# EAGLE design neopixelwordclock (EAGLE 7.6.0)
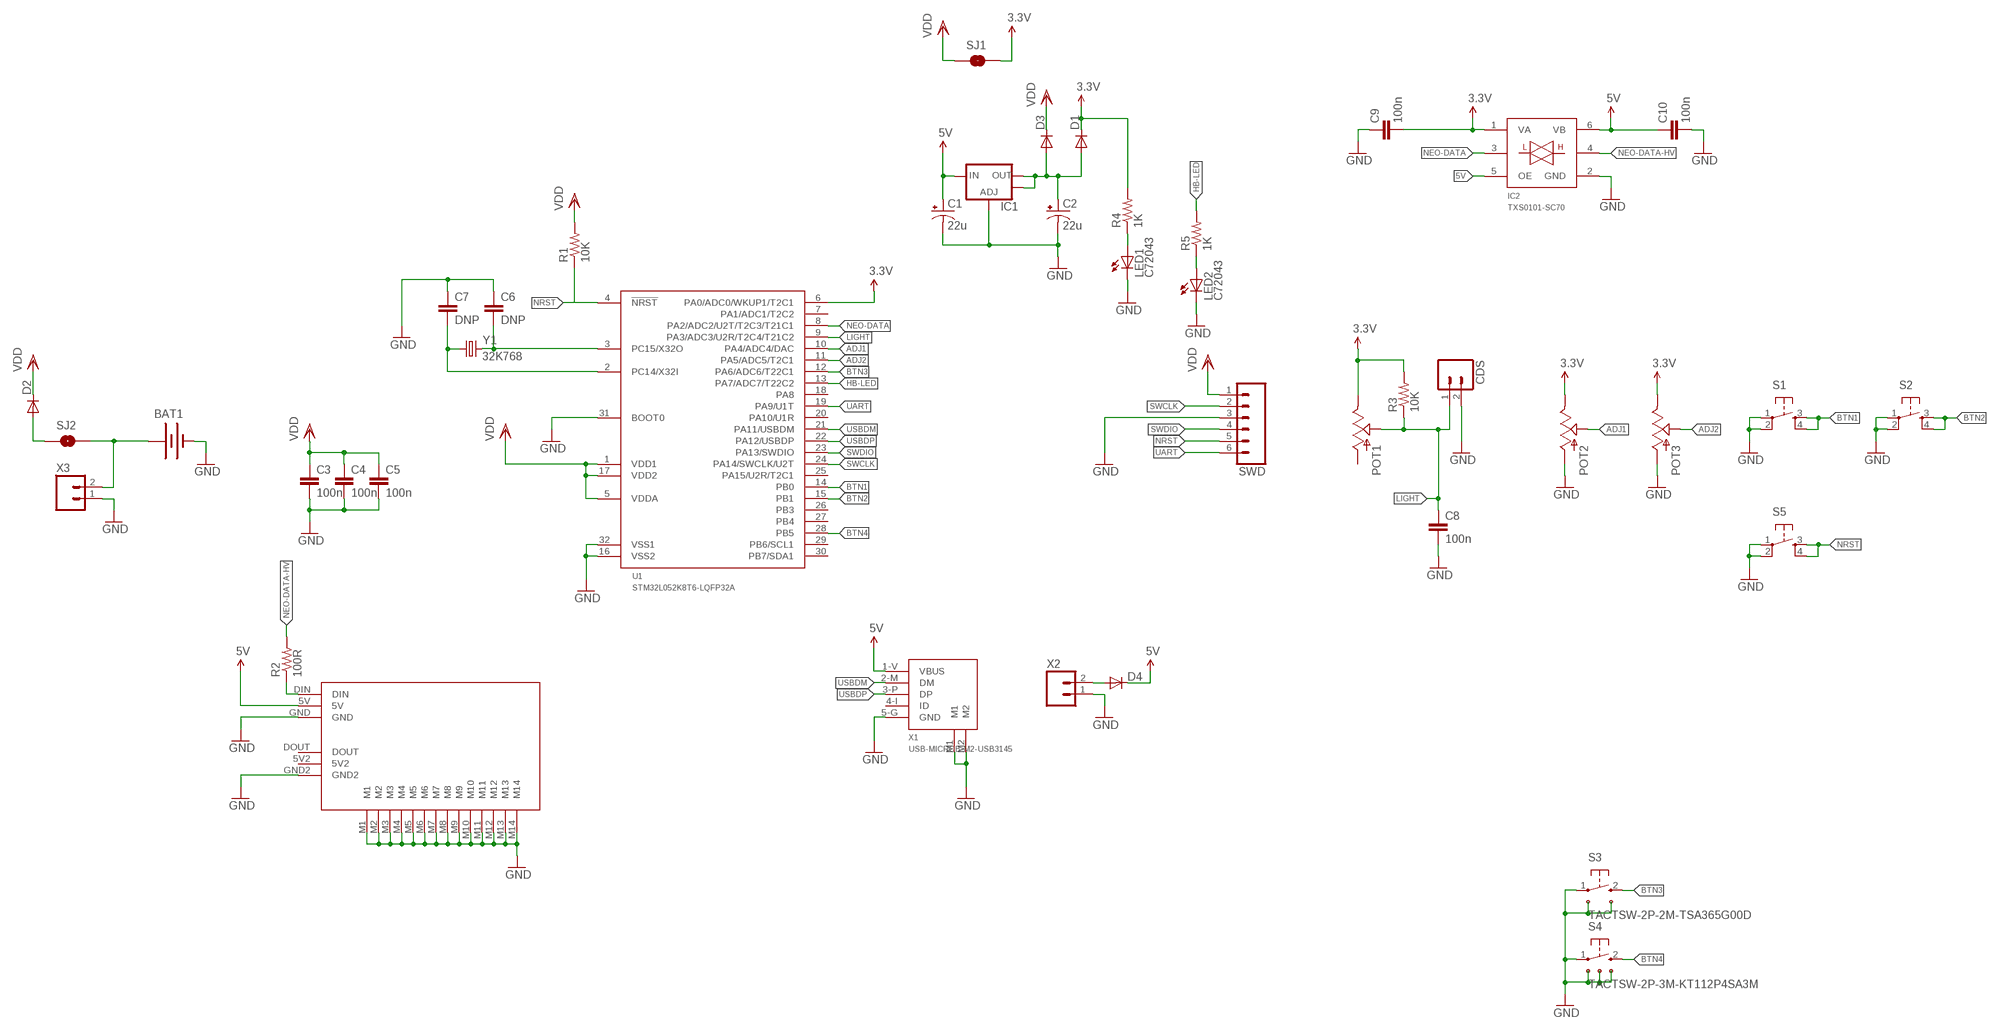
[diagram p0: schematic, sheet 1]

## Parts
BAT1  BATTERY-JLC  [BATT-COIN-CR2032-BS-6-1]
C1  22u  CAP_POL3528  [EIA3528]
C2  22u  CAP_POL3528  [EIA3528]
C3  100n  CAP0603-CAP  [0603-CAP]
C4  100n  CAP0603-CAP  [0603-CAP]
C5  100n  CAP0603-CAP  [0603-CAP]
C6  DNP  CAP0603-CAP  [0603-CAP]
C7  DNP  CAP0603-CAP  [0603-CAP]
C8  100n  CAP0603-CAP  [0603-CAP]
C9  100n  CAP0603-CAP  [0603-CAP]
C10  100n  CAP0603-CAP  [0603-CAP]
CDS  M02PTH  [1X02]
D1  DIODESOD  [SOD-323]
D2  DIODESOD  [SOD-323]
D3  DIODESOD  [SOD-323]
D4  DIODESMA  [SMA-DIODE]
IC1  V_REG_LM1117SOT223  [SOT223]
IC2  TXS0101-SC70  [SC70-6]
LED1  C72043  LED0603  [LED-0603]
LED2  C72043  LED0603  [LED-0603]
POT1  POT-SMD-A  [POT-SMD]
POT2  POT-SMD-A  [POT-SMD]
POT3  POT-SMD-A  [POT-SMD]
R1  10K  RESISTOR0603-RES  [0603-RES]
R2  100R  RESISTOR0603-RES  [0603-RES]
R3  10K  RESISTOR0603-RES  [0603-RES]
R4  1K  RESISTOR0603-RES  [0603-RES]
R5  1K  RESISTOR0603-RES  [0603-RES]
S1  TAC_SWITCHSMD  [TACTILE_SWITCH_SMD]
S2  TAC_SWITCHSMD  [TACTILE_SWITCH_SMD]
S3  TACTSW-2P-2M-TSA365G00D  [TACTSW-SMD-SIDE-TSA365G00D]
S4  TACTSW-2P-3M-KT112P4SA3M  [TACTSW-SMD-SIDE-KT11P4SA3M]
S5  TAC_SWITCHSMD  [TACTILE_SWITCH_SMD]
SJ1  SOLDERJUMPERNO  [SJ_2S-NO]
SJ2  SOLDERJUMPER-BIG  [SJ_2S_BIG]
SWD  M06FEMALE_LOCK  [1X06_FEMALE_LOCK.010]
U1  STM32L052K8T6-LQFP32A  [LQFP32]
U$1  PCB-OUTLINE  [PCB-OUTLINE]
X1  USB-MICROB-M2-USB3145  [USBMICROBVERT-USB3145]
X2  M02-JST-2-PTH-NO_SILK  [JST-2-PTH-NS]
X3  M02-JST-2-PTH-NO_SILK  [JST-2-PTH-NS]
Y1  32K768  CRYSTAL-3.2X1.5  [XTAL-3.2X1.5]

## Nets
3.3V: C9.2 D1.1(C) IC2.1(VA) POT1.A(B) POT2.A(B) POT3.A(B) R3.2 R4.2 SJ1.2 U1.6(PA0/ADC0/WKUP1/T2C1)
5V: C1.A(+) C10.1 D4.C IC1.3(IN) IC2.5(OE) IC2.6(VB) U$1.5V X1.1-V(VBUS)
ADJ1: POT2.W U1.10(PA4/ADC4/DAC)
ADJ2: POT3.W U1.11(PA5/ADC5/T2C1)
BTN1: S1.3 S1.4 U1.14(PB0)
BTN2: S2.3 S2.4 U1.15(PB1)
BTN3: S3.2 U1.12(PA6/ADC6/T22C1)
BTN4: S4.2 U1.28(PB5)
GND: BAT1.NEG(-) C1.C(-) C2.C(-) C3.2 C4.2 C5.2 C6.1 C7.1 C8.2 C9.1 C10.2 CDS.2 IC1.1(ADJ) IC2.2(GND) LED1.C LED2.C POT2.B(A) POT3.B(A) S1.1 S1.2 S2.1 S2.2 S3.1 S3.M1 S3.M2 S4.1 S4.M1 S4.M2 S4.M3 S5.1 S5.2 SWD.3 U1.16(VSS2) U1.31(BOOT0) U1.32(VSS1) U$1.GND U$1.GND2 U$1.M1 U$1.M2 U$1.M3 U$1.M4 U$1.M5 U$1.M6 U$1.M7 U$1.M8 U$1.M9 U$1.M10 U$1.M11 U$1.M12 U$1.M13 U$1.M14 X1.5-G(GND) X1.M1 X1.M2 X2.1 X3.1
HB-LED: R5.2 U1.13(PA7/ADC7/T22C2)
LIGHT: C8.1 CDS.1 POT1.W R3.1 U1.9(PA3/ADC3/U2R/T2C4/T21C2)
N$1: BAT1.POS(+) SJ2.2 X3.2
N$2: C2.A(+) D1.2(A) D3.2(A) IC1.2(OUT) IC1.4(OUT)
N$3: C6.2 U1.3(PC15/X32O) Y1.2
N$4: C7.2 U1.2(PC14/X32I) Y1.1
N$5: R2.1 U$1.DIN
N$6: D4.A X2.2
N$7: D2.2(A) SJ2.1
N$8: LED2.A R5.1
N$9: LED1.A R4.1
NEO-DATA: IC2.3(A) U1.8(PA2/ADC2/U2T/T2C3/T21C1)
NEO-DATA-HV: IC2.4(B) R2.2
NRST: R1.1 S5.3 S5.4 SWD.5 U1.4(!NRST)
SWCLK: SWD.2 U1.24(PA14/SWCLK/U2T)
SWDIO: SWD.4 U1.23(PA13/SWDIO)
UART: SWD.6 U1.19(PA9/U1T)
USBDM: U1.21(PA11/USBDM) X1.2-M(DM)
USBDP: U1.22(PA12/USBDP) X1.3-P(DP)
VDD: C3.1 C4.1 C5.1 D2.1(C) D3.1(C) R1.2 SJ1.1 SWD.1 U1.1(VDD1) U1.5(VDDA) U1.17(VDD2)
Unconnected: POT1.B(A) U1.7(PA1/ADC1/T2C2) U1.18(PA8) U1.20(PA10/U1R) U1.25(PA15/U2R/T2C1) U1.26(PB3) U1.27(PB4) U1.29(PB6/SCL1) U1.30(PB7/SDA1) U$1.5V2 U$1.DOUT X1.4-I(ID)

## Library data of the parts
BAT1 = neopixelwordclock:BATTERY: Battery Holders Various common sizes : AA, AAA, 20mm coin cell and 12mm coin cell.
C1 C2 = neopixelwordclock:CAP_POL: Capacitor Polarized These are standard SMD and PTH capacitors. Normally 10uF, 47uF, and 100uF in electrolytic and tantalum varieties. Always verify the external diameter of the through hole cap, it varies with capacity, voltage, and manufacturer. The EIA devices should be standard.
C3-C10 = neopixelwordclock:CAP: Capacitor Standard 0603 ceramic capacitor, and 0.1" leaded capacitor.
CDS X2 X3 = neopixelwordclock:M02: Header 2 Standard 2-pin 0.1" header. Use with straight break away headers (SKU : PRT-00116), right angle break away headers (PRT-00553), swiss pins (PRT-00743), machine pins (PRT-00117), and female headers (PRT-00115). Molex polarized connector foot print use with SKU : PRT-08233 with associated crimp pins and housings.
D1-D4 = neopixelwordclock:DIODE: Diode These are standard reverse protection diodes and small signal diodes. SMA package can handle up to about 1A. SOD-323 can handle about 200mA. What the SOD-323 package when ordering, there are some mfgs out there that are 5-pin packages.
IC1 = neopixelwordclock:V_REG_LM1117: Voltage Regulator LM1117 Standard adjustable voltage regulator but in SMD form. Spark Fun Electronics SKU : COM-00595
IC2 = neopixelwordclock:TXS0101
LED1 LED2 = neopixelwordclock:LED: LEDs Standard schematic elements and footprints for 5mm, 3mm, 1206, and 0603 sized LEDs. 5mm - Spark Fun Electronics SKU : COM-00529 (and others)
POT1-POT3 = neopixelwordclock:POT
R1-R5 = neopixelwordclock:RESISTOR: Resistor Basic schematic elements and footprints for 0603, 1206, and PTH resistors.
S1 S2 S5 = neopixelwordclock:TAC_SWITCH: Momentary Switch Button commonly used for reset or general input. Spark Fun Electronics SKU : COM-00097
S3 = neopixelwordclock:TACTSW-2P-2M
S4 = neopixelwordclock:TACTSW-2P-3M
SJ1 SJ2 = neopixelwordclock:SOLDERJUMPER: Solder Jumper Standard SMD solder jumper. Used to automate production. Two varients : Normally Open and Normally Closed are the same, but have different paste layers. NC will have a large amount of paste and should jumper during reflow.
SWD = neopixelwordclock:M06: Header 6 Standard 6-pin 0.1" header. Use with straight break away headers (SKU : PRT-00116), right angle break away headers (PRT-00553), swiss pins (PRT-00743), machine pins (PRT-00117), and female headers (PRT-00115). Molex polarized connector foot print use with SKU : PRT-08094 with associated crimp pins and housings. NOTES ON THE VARIANTS LOCK and LOCK_LONGPADS... This footprint was designed to help hold the alignment of a through-hole component (i.e. 6-pin header) while soldering it into place. You may notice that each hole has been shifted either up or down by 0.005 of an inch from it's more standard position (which is a perfectly straight line). This slight alteration caused the pins (the squares in the middle) to touch the edges of the holes. Because they are alternating, it causes a "brace" to hold the component in place. 0.005 has proven to be the perfect amount of "off-center" position when using our standard breakaway headers. Although looks a little odd when you look at the bare footprint, once you have a header in there, the alteration is very hard to notice. Also, if you push a header all the way into place, it is covered up entirely on the bottom side. This idea of altering the position of holes to aid alignment will be further integrated into the Sparkfun Library for other footprints. It can help hold any component with 3 or more connection pins.
U1 = neopixelwordclock:STM32L052K8T6
U$1 = neopixelwordclock:PCB-OUTLINE
X1 = neopixelwordclock:USB-MICROB-M2
Y1 = neopixelwordclock:CRYSTAL: Crystals Various standard crystals. Proven footprints. Spark Fun Electronics SKU : COM-00534

## Board
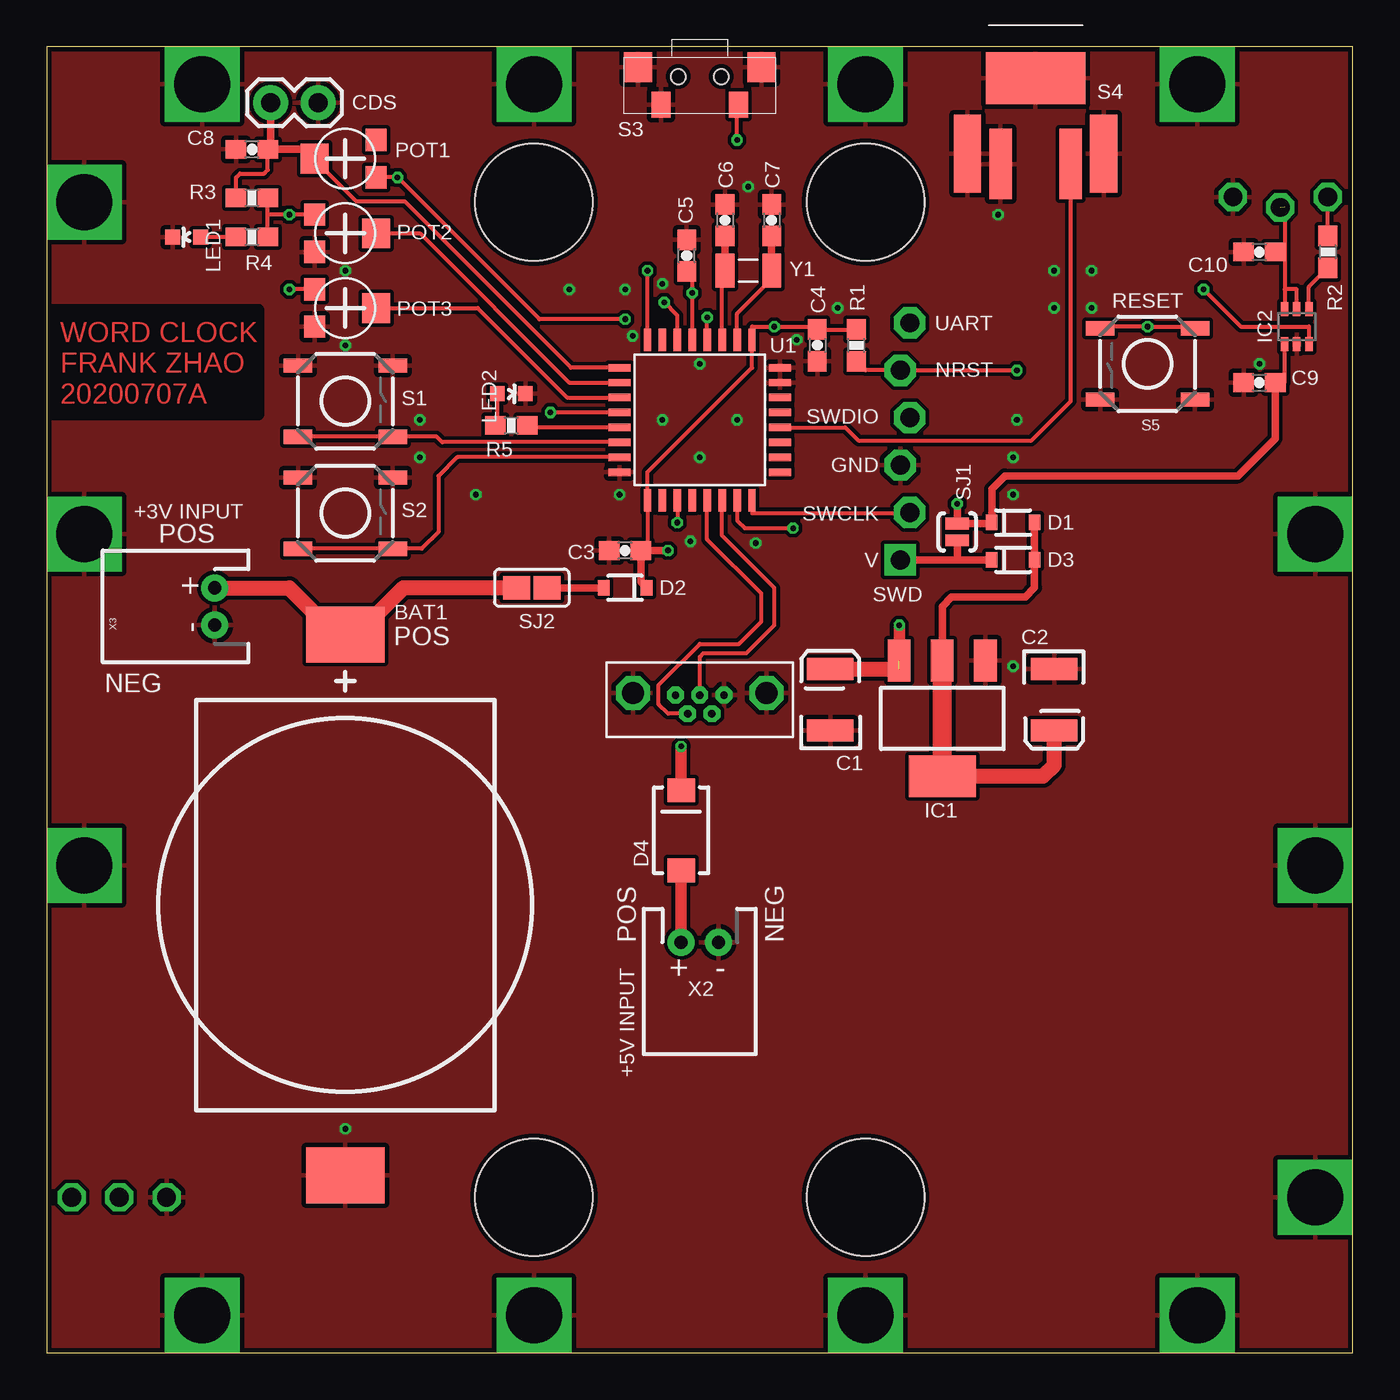
[diagram p1: board, top side]
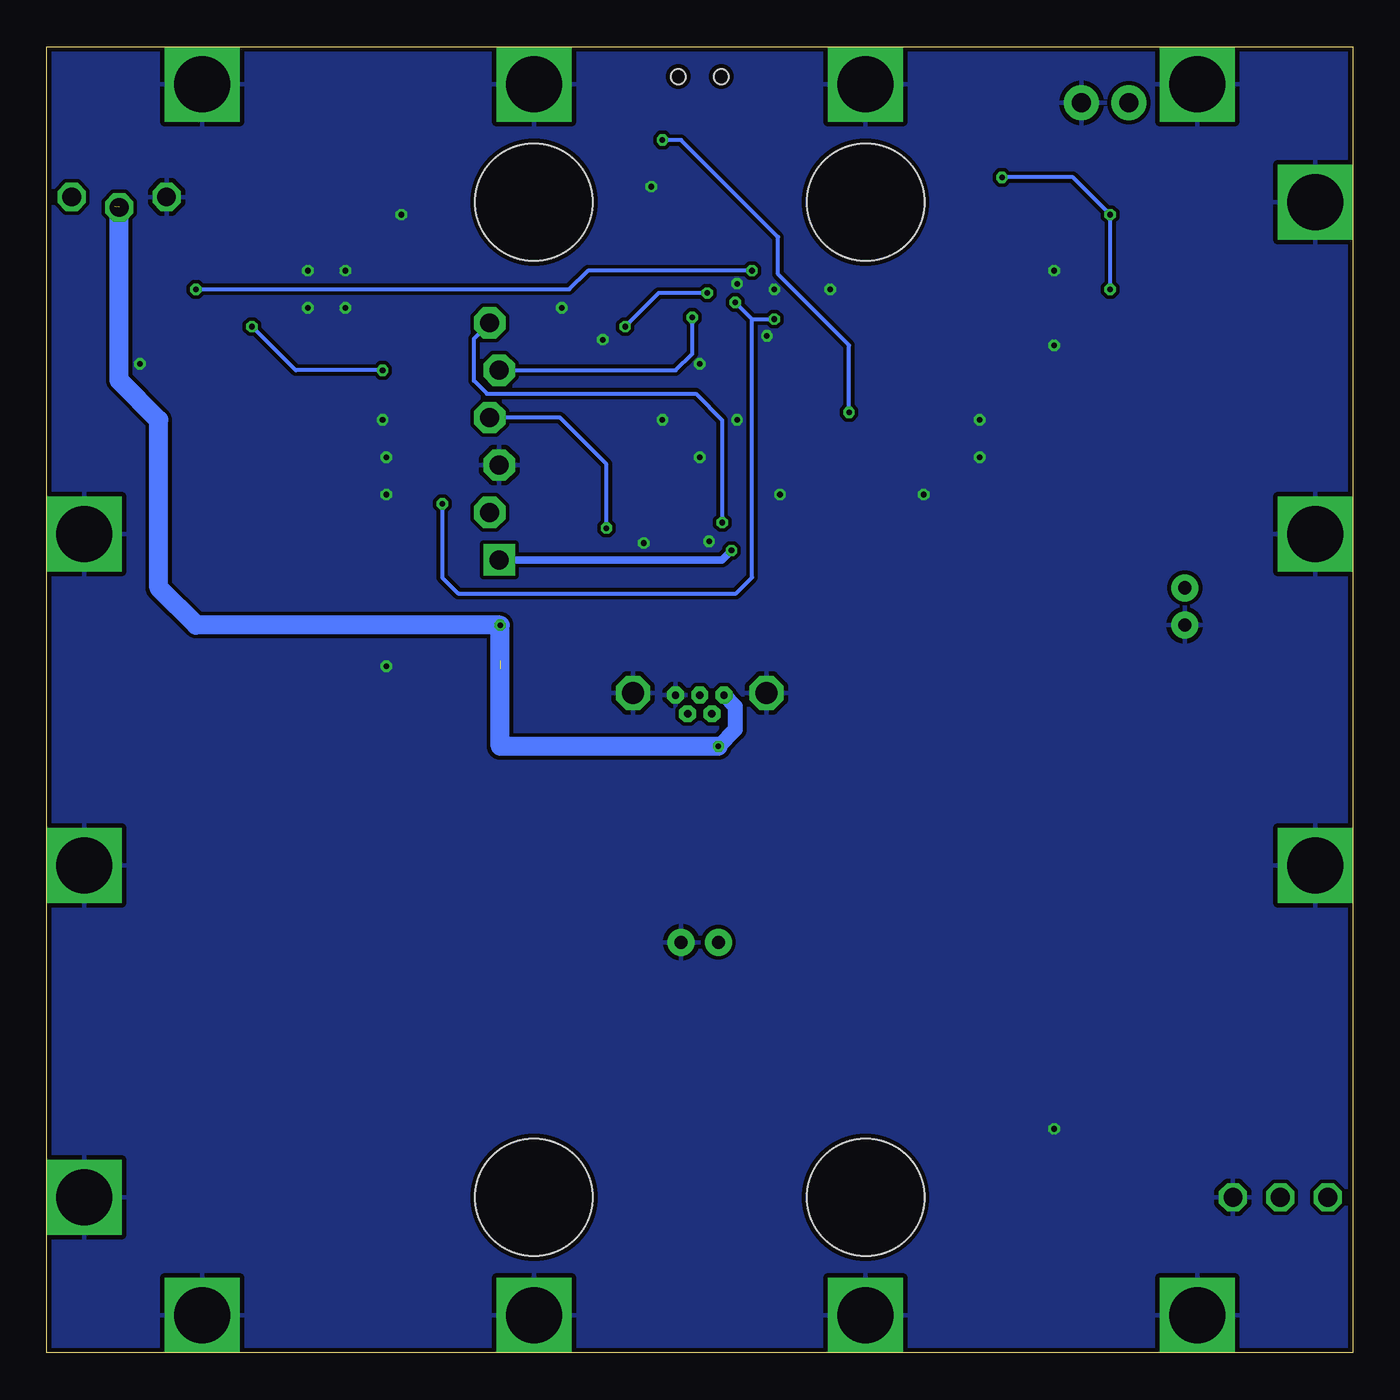
[diagram p2: board, bottom side, seen from below]

Size 70 x 70 mm. Coordinates in mm from the lower left corner, seen from the top.
Copper layers (1*16): Top 0.035mm / dielectric 1.5mm / Bottom 0.035mm
Design rules "designrulecheck": minimum track width 6mil, minimum drill 0.3mm, track to track 7mil, track to pad 7mil, pad to pad 7mil, via to via 7mil, smd to smd 0mil, copper to edge 10mil, drill to drill 10mil, minimum pad ring 10mil, minimum via ring 6mil, stop-mask expansion 2mil, vias tented up to drill 25mil, thermal gap 10mil

### Footprints (pad centres in the part's own frame; a part is rotated, then mirrored left to right if it is on the bottom)
BATT-COIN-CR2032-BS-6-1 = smd 3 x 4.2: NEG -14.5,0; POS 14.5,0
EIA3528 = smd 1.2 x 2.5: A 1.65,0; C -1.65,0
0603-CAP = smd 1.1 x 1: 1 -0.85,0; 2 0.85,0
1X02 = drill 1.016 pad 1.88: 1 0,0; 2 2.54,0
SOD-323 = smd 0.63 x 0.83: 1 -1.15,0; 2 1.15,0
SMA-DIODE = smd 1.27 x 1.47: A -2.15,0; C 2.15,0
SOT223 = smd 1.219 x 2.235: 1 -2.311,-3.099; 2 0,-3.099; 3 2.311,-3.099 | smd 3.6 x 2.2: 4 0,3.099
SC70-6 = smd 0.4 x 0.75: 1 -0.65,-0.925; 2 0,-0.925; 3 0.65,-0.925; 4 0.65,0.925; 5 0,0.925; 6 -0.65,0.925
LED-0603 = smd 0.8 x 0.8: A -0.75,0; C 0.75,0
POT-SMD = smd 1.2 x 1.12: A -1,-1.65; B 1,-1.65 | smd 1.6 x 1.5: W 0,1.65
0603-RES = smd 1.1 x 1: 1 -0.85,0; 2 0.85,0
TACTILE_SWITCH_SMD = smd 1.524 x 0.762: 1 -2.54,1.905; 2 2.54,1.905; 3 -2.54,-1.905; 4 2.54,-1.905
TACTSW-SMD-SIDE-TSA365G00D = smd 1 x 1.4: 1 -2.075,-1.5; 2 2.075,-1.5 | smd 1.5 x 1.6: M1 -3.3,0.5; M2 3.3,0.5 | hole 0.8: -1.15,0; 1.15,0
TACTSW-SMD-SIDE-KT11P4SA3M = smd 3.759 x 1.206: 1 3.581,-1.88; 2 3.581,1.88 | smd 2.794 x 5.334: M1 -1.016,0 | smd 4.191 x 1.46: M2 3.035,-3.651; M3 3.035,3.651
SJ_2S-NO = smd 0.635 x 1.27: 1 -0.45,0; 2 0.45,0
SJ_2S_BIG = smd 1.435 x 1.27: 1 -0.812,0; 2 0.812,0
1X06_FEMALE_LOCK.010 = drill 1.016 pad 1.676 square: 1 0,0.254 | drill 1.016 pad 1.676 octagon: 2 2.54,-0.254; 3 5.08,0.254; 4 7.62,-0.254; 5 10.16,0.254; 6 12.7,-0.254
LQFP32 = smd 0.4 x 1.2: 1 -2.8,-4.3; 2 -2,-4.3; 3 -1.2,-4.3; 4 -0.4,-4.3; 5 0.4,-4.3; 6 1.2,-4.3; 7 2,-4.3; 8 2.8,-4.3; 17 2.8,4.3; 18 2,4.3; 19 1.2,4.3; 20 0.4,4.3; 21 -0.4,4.3; 22 -1.2,4.3; 23 -2,4.3; 24 -2.8,4.3 | smd 1.2 x 0.4: 9 4.3,-2.8; 10 4.3,-2; 11 4.3,-1.2; 12 4.3,-0.4; 13 4.3,0.4; 14 4.3,1.2; 15 4.3,2; 16 4.3,2.8; 25 -4.3,2.8; 26 -4.3,2; 27 -4.3,1.2; 28 -4.3,0.4; 29 -4.3,-0.4; 30 -4.3,-1.2; 31 -4.3,-2; 32 -4.3,-2.8
PCB-OUTLINE = drill 1 octagon: 5V 31.12,26.39; 5V2 -31.12,-26.67; DIN 33.66,26.95; DOUT -33.66,-26.67; GND 28.58,26.95; GND2 -28.58,-26.67 | drill 3 pad 3.4 square: M1 -26.67,-33; M2 -8.89,-33; M3 8.89,-33; M4 26.67,-33; M5 33,-26.67; M6 33,-8.89; M7 33,8.89; M8 26.67,33; M9 8.89,33; M10 -8.89,33; M11 -26.67,33; M12 -33,26.67; M13 -33,8.89; M14 -33,-8.89 | hole 6.3: -8.89,26.67; 8.89,26.67; -8.89,-26.67; 8.89,-26.67
USBMICROBVERT-USB3145 = drill 0.4 pad 0.8 octagon: 1-V -1.3,0.25; 2-M -0.65,-0.75; 3-P 0,0.25; 4-I 0.65,-0.75; 5-G 1.3,0.25 | drill 1.2 octagon: M1 -3.575,0.36; M2 3.575,0.36
JST-2-PTH-NS = drill 0.7 pad 1.448: 1 -1,0; 2 1,0
XTAL-3.2X1.5 = smd 1 x 1.8: 1 -1.25,0; 2 1.25,0

### Placement (x,y rotation side)
BAT1  16,24 90 top
C1  42,35 90 top
C2  54,35 270 top
C3  31,43 180 top
C4  41.3,54 270 top
C5  34.3,58.8 90 top
C6  36.35,60.7 270 top
C7  38.85,60.7 270 top
C8  11,64.5 180 top
C9  65,52 0 top
C10  65,59 180 top
CDS  12,67 0 top
D1  51.8,44.5 0 top
D2  31,41 180 top
D3  51.8,42.5 0 top
D4  34,28 90 top
IC1  48,34 180 top
IC2  67,55 0 top
LED1  7.5,59.8 180 top
LED2  24.9,51.4 0 top
POT1  16,64 90 top
POT2  16,60 270 top
POT3  16,56 270 top
R1  43.4,54 90 top
R2  68.66,59 270 top
R3  11,61.9 0 top
R4  11,59.8 0 top
R5  24.9,49.7 0 top
S1  16,51 0 top
S2  16,45 0 top
S3  35,68.4 0 top
S4  53,67.3 270 top
S5  59,53 180 top
SJ1  48.8,44 90 top
SJ2  26,41 180 top
SWD  46,42.5 90 top
U1  35,50 180 top
U$1  35,35 0 top
X1  35,35 0 top
X2  35,22 180 top
X3  9,40 90 top
Y1  37.6,58 180 top

### Tracks (layer width: path | path; a pad name or v marks a point on that pad's centre or on a via)
3.3V  (via drill 0.3)
  Top 0.203: U1.6 33.8,55.6 v33.1,56.3 | v31,55.4 26.4,55.4 v18.8,63 POT1.A | POT3.A v13,57 | POT2.A v13,61 11.85,61 | C9.2 66.35,52 IC2.1 | 12.1,61.9 R3.2 11.85,61 | R4.2 11.85,61
  Top 0.406: v48.8,45.5 SJ1.2 50.4,44.45 D1.1 50.65,46.3 51.35,47 63.84,47 65.85,49.01 C9.2
  Bottom 0.203: v48.8,45.5 48.8,41.55 47.95,40.7 33.05,40.7 32.2,41.55 32.2,55.4 | 32.2,55.4 v33.1,56.3 | 32.2,55.4 v31,55.4 | v13,57 v13,61 15,63 v18.8,63
5V  (via drill 0.3)  (2 unrouted)
  Top 0.203: 66.35,61.44 66.35,59 | 66.35,59 66.35,57 | 66.35,57 IC2.6 | IC2.5 67,57 66.35,57 | C10.1 66.35,59
  Top 0.61: D4.C v34,32.5 | IC1.3 v45.7,39
  Top 0.813: C1.A 45.69,36.65
  Bottom 0.813: X1.1-V 33.1,34.65 33.1,33.4 v34,32.5
  Bottom 1.016: U$1.5V 66.12,52.12 64,50 64,41 62,39 v45.7,39 45.7,32.5 v34,32.5
ADJ1
  Top 0.203: POT2.W 20,60 28,52 U1.10
ADJ2
  Top 0.203: POT3.W 23.1,56 27.9,51.2 U1.11
BTN1
  Top 0.203: U1.14 21.2,48.8 20.91,49.09 S1.4 S1.3
BTN2
  Top 0.203: U1.15 22,48 21,47 21,44 20.09,43.09 S2.4 S2.3
BTN3  (via drill 0.3)
  Top 0.203: U1.12 v27,50.4 | v37,65 37,66.5 S3.2
  Bottom 0.203: v27,50.4 27,54 30.8,57.8 30.8,59.8 36,65 v37,65
BTN4
  Top 0.203: U1.28 42.8,49.6 43.5,48.9 52.78,48.9 54.88,51 S4.2
GND  (via drill 0.3)
  other vias: 16,12 51.8,36.8 34.5,43.5 38,43.4 30.7,46 33,50 35,48 37,50 35,53 40.2,54.3 37.6,62.5 31.4,54.5 33,57.3 16,58 16,54 51,61 56,56 54,56 54,58 56,58 65,53 51.8,46 52,50 42.4,56 20,48 20,50 23,46 28,57 31,57 51.8,48
  pour Bottom (isolate 0.203): 0,0 70,0 70,70 0,70
  pour Top (isolate 0.203): 0,0 70,0 70,70 0,70
HB-LED
  Top 0.203: U1.13 25.75,49.6 R5.2
LIGHT
  Top 0.203: U1.9 28.1,52.8 19.2,61.7 16.6,61.7 14.3,64 POT1.W | R3.1 10.15,62.99 10.36,63.2 11.64,63.2 11.85,63.41 C8.1
  Top 0.406: POT1.W 14.35,64.5 C8.1 12,64.4 CDS.1
N$1
  Top 0.813: SJ2.2 19.1,41 17.6,39.5 16,39.5 BAT1.POS 16,38 13,41 X3.2
N$2
  Top 0.406: D1.2 D3.2 52.95,41 52.45,40.5 48.5,40.5 48,40 IC1.2
  Top 0.813: IC1.4 53.4,30.9 54,31.5 C2.A
  Top 1.016: IC1.4 IC1.2
N$3
  Top 0.203: U1.3 36.2,57.85 Y1.2
  Top 0.406: C6.2 Y1.2
N$4
  Top 0.203: U1.2 37,55.7 38.85,57.55 Y1.1
  Top 0.406: C7.2 Y1.1
N$5
  Top 0.203: R2.1 U$1.DIN
N$6
  Top 0.61: X2.2 D4.A
N$7
  Top 0.406: D2.2 SJ2.1
N$8
  Top 0.203: R5.1 24.15,49.7 LED2.A
N$9
  Top 0.203: R4.1 LED1.A
NEO-DATA  (via drill 0.3)
  Top 0.203: U1.8 v32.2,58 | IC2.3 67.65,55 64,55 v62,57
  Bottom 0.203: v32.2,58 41,58 42,57 v62,57
NEO-DATA-HV
  Top 0.203: IC2.4 67.65,57.14 R2.2
NRST  (via drill 0.3)
  Top 0.203: U1.4 v35.4,55.5 | R1.1 43.89,52.66 SWD.5 v52,52.66 | S5.4 56.55,55 v59,55 61.45,55 S5.3
  Bottom 0.203: SWD.5 36.29,52.66 35.4,53.55 v35.4,55.5 | v52,52.66 56.66,52.66 v59,55
SWCLK
  Top 0.203: U1.24 37.8,45 46.25,45 SWD.2
SWDIO  (via drill 0.3)
  Top 0.203: U1.23 37,44.61 37.41,44.2 v40,44.2
  Bottom 0.203: v40,44.2 40,47.62 42.5,50.12 SWD.4
UART  (via drill 0.3)
  Top 0.203: U1.19 v33.8,44.5
  Bottom 0.203: SWD.6 47.1,54.35 47.1,52.1 46.4,51.4 35.21,51.4 33.8,49.99 v33.8,44.5
USBDM
  Top 0.203: X1.2-M 33.3,34.25 32.8,34.75 32.8,35.8 35,38 37.1,38 38.3,39.2 38.3,40.7 35.4,43.6 U1.21
USBDP
  Top 0.203: X1.3-P 35,37.3 35.2,37.5 37.5,37.5 39,39 39,41 36.2,43.8 U1.22
VDD  (via drill 0.3)
  Top 0.203: C3.1 32.2,43 U1.17 32.2,47.2 37.8,52.8 U1.1 37.8,55 v39,55 41.3,55 C4.1 R1.2 | U1.5 v34.6,56.8 34.6,57.95 C5.1
  Top 0.406: SWD.1 48.8,42.5 | 48.8,42.5 D3.1 | SJ1.1 48.8,42.5 | v33.3,43 C3.1 31.85,41.3 D2.1
  Bottom 0.203: v34.6,56.8 37.2,56.8 v39,55
  Bottom 0.406: v33.3,43 33.8,42.5 SWD.1

### Text on the board
tPlace: RESET | UART | NRST | SWDIO | GND | +3V INPUT | SWCLK | POS | V | POS | NEG | POS | NEG | +5V INPUT